# Altium schematic sheet Tp_Buzzer.SchDoc
size A4
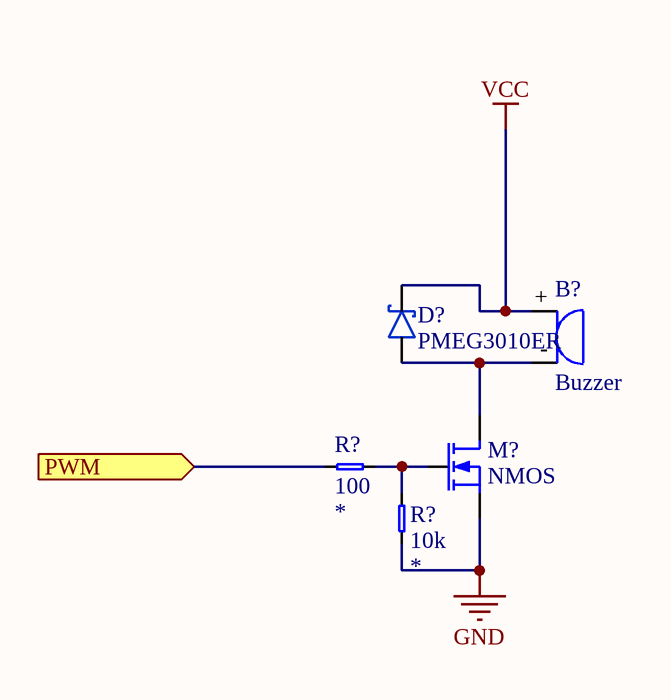
[diagram p0: Tp_Buzzer.SchDoc]

## Parts
(Parts that share a designator on the sheet are numbered #1, #2 ... from top to bottom, then left to right.)
B?  Buzzer  [SD160709]
D?  PMEG3010ER  [SOD123W]
M?  NMOS  [MOSFET-SOT23]
R?#1  value 100  [0402_RES_LD]  (hidden comment: Resistor)
R?#2  value 10k  [0603_RES_LD]  (hidden comment: Resistor)

## Ports
PWM (in)

## Nets
GND: M?.S R?#2.1
VCC: B?.+ D?.K
PWM: R?#1.1 ; port PWM
NetB?_-: B?.- D?.A M?.D
NetM?_G: M?.G R?#1.2 R?#2.2

## Library data of the parts
B? = SD160709: TDK SD160709 Buzzer; Reference: SD160709
D? = Schottky_PMEG3010ER: Nexperia 1A low Vf Mega Schottky barrier rectifier; Reference: PMEG3010ER
M? = N-MOSFET: N MOSFET
R?#1 R?#2 = Resistor: Precision: *; Package: *